# EAGLE design nes2p (EAGLE 7.7.0)
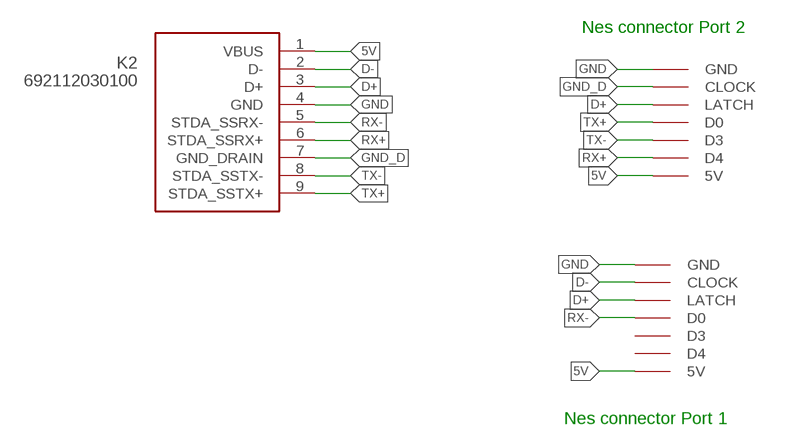
[diagram p0: schematic, sheet 1]

## Parts
K2  692112030100  [692112030100]
U$1  NESCONNNO_TABS  [NESCONN_NO_TABS]
U$2  NESCONNNO_TABS  [NESCONN_NO_TABS]

## Nets
5V: K2.1(VBUS) U$1.5V U$2.5V
D+: K2.3(D+) U$1.LATCH U$2.LATCH
D-: K2.2(D-) U$2.CLOCK
GND: K2.4(GND) U$1.GND U$2.GND
GND_D: K2.7(GND_DRAIN) U$1.CLOCK
RX+: K2.6(STDA_SSRX+) U$1.D4
RX-: K2.5(STDA_SSRX-) U$2.D0
TX+: K2.9(STDA_SSTX+) U$1.D0
TX-: K2.8(STDA_SSTX-) U$1.D3
Unconnected: U$2.D3 U$2.D4

## Notes on the sheet
- Nes connector Port 2
- Nes connector Port 1

## Library data of the parts
K2 = Wuerth_Elektronik_eiCan_Communication_Connectors_STENCIL:692112030100: WR-COM USB 3.0 SMT PLUG WITH CLIPTYPE A
U$1 U$2 = gamepad-conn:NESCONN

## Board
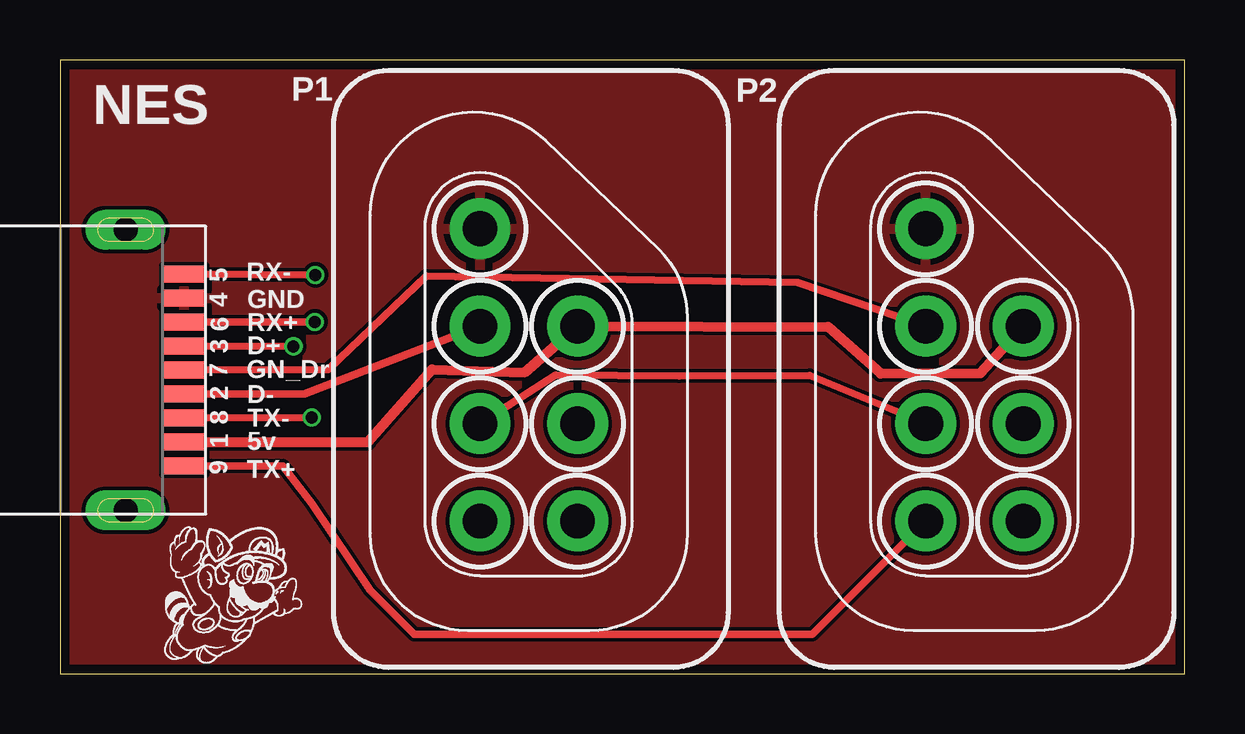
[diagram p1: board, top side]
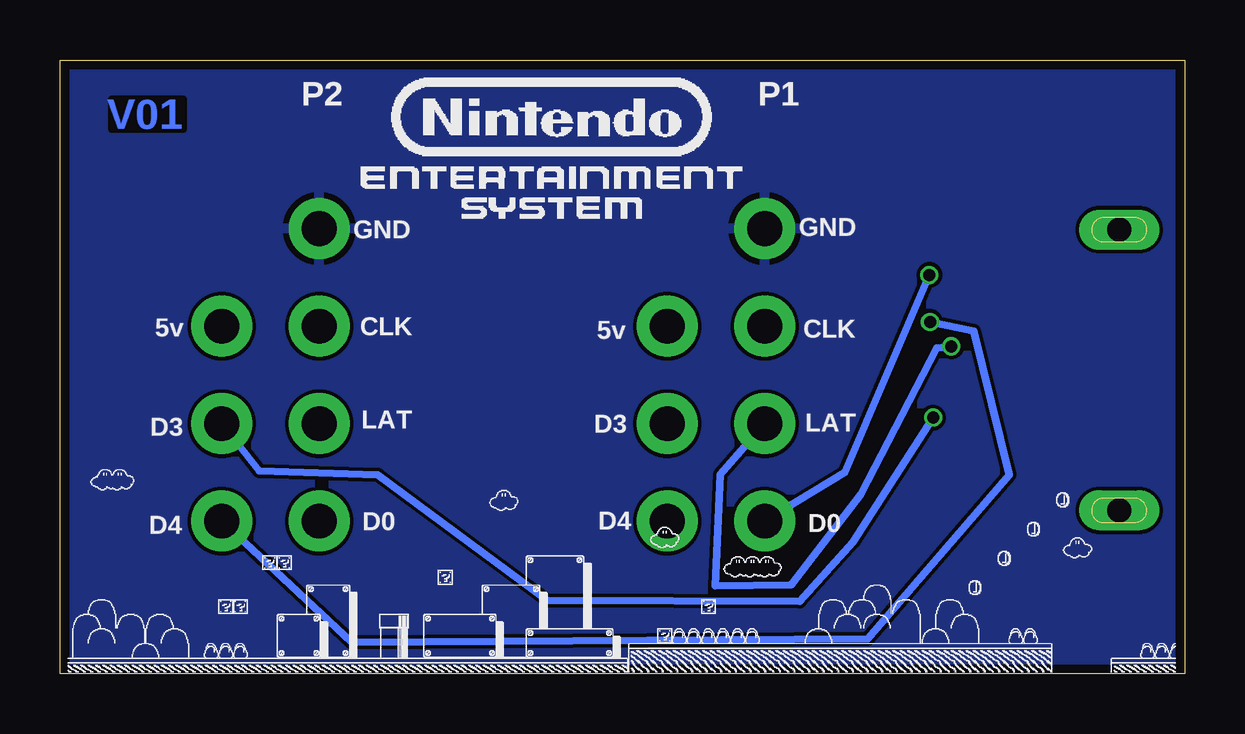
[diagram p2: board, bottom side, seen from below]

Size 46.87 x 25.6 mm. Coordinates in mm from the lower left corner, seen from the top.
Outline: 0,0 46.87,0 46.87,25.6 0,25.6 0,0
Copper layers (1*16): Top 0.035559375mm / dielectric 1.6mm / Bottom 0.035559375mm
Design rules "oshpark-2layer": minimum track width 6mil, minimum drill 10mil, track to track 6mil, track to pad 6mil, pad to pad 6mil, via to via 6mil, smd to smd 6mil, copper to edge 15mil, drill to drill 6mil, minimum pad ring 5mil, minimum via ring 5mil, stop-mask expansion 2.5mil, vias tented up to drill 0mil, thermal gap 10mil

### Footprints (pad centres in the part's own frame; a part is rotated, then mirrored left to right if it is on the bottom)
692112030100 = smd 0.7 x 1.8: 1 -3,0; 2 -1,0; 3 1,0; 4 3,0; 5 4,0; 6 2,0; 7 0,0; 8 -2,0; 9 -4,0 | drill 1 pad 1.676 long: Z1 5.85,2.45; Z2 -5.85,2.45
NESCONN_NO_TABS = drill 1.448 pad 2.54: 5V 8.128,0; CLOCK 8.128,4.064; D0 0,4.064; D3 4.064,0; D4 0,0; GND 12.192,4.064; LATCH 4.064,4.064

### Placement (x,y rotation side)
K2  5.18,12.67 90 top
U$1  40.13,6.38 90 top
U$2  21.56,6.38 90 top

### Tracks (layer width: path | path; a pad name or v marks a point on that pad's centre or on a via)
5V
  Top 0.406: K2.1 12.82,9.67 15.49,12.7 19.36,12.57 U$2.5V 32,14.48 34.19,12.52 38.35,12.55 U$1.5V
D+  (via drill 0.5)
  Top 0.305: U$2.LATCH 20.65,12.47 25.81,12.42 31.24,12.45 U$1.LATCH | K2.3 v9.73,13.67
  Bottom 0.305: v9.73,13.67 10.34,13.59 13.51,7.49 16.41,3.71 19.56,3.68 19.36,8.33 U$2.LATCH
D-
  Top 0.305: K2.2 10.19,11.68 U$2.CLOCK
GND
  pour Bottom: 0.1,25.37 46.69,25.32 46.74,0.08 0.1,-0.03
  pour Top: 0.3,25.45 46.69,25.37 46.76,0.13 0.05,0
GND_D
  Top 0.305: K2.7 11.18,12.7 15.27,16.59 30.73,16.33 U$1.CLOCK
RX+  (via drill 0.5)
  Top 0.305: K2.6 v10.62,14.68
  Bottom 0.305: v10.62,14.68 8.79,14.3 7.32,8.31 13.21,1.47 34.72,1.32 U$1.D4
RX-  (via drill 0.5)
  Top 0.305: K2.5 v10.64,16.64
  Bottom 0.305: v10.64,16.64 14.17,8.41 U$2.D0
TX+
  Top 0.305: K2.9 9.28,8.67 10.49,7.11 12.93,3.48 14.76,1.65 31.34,1.65 U$1.D0
TX-  (via drill 0.5)
  Top 0.305: K2.8 v10.49,10.69
  Bottom 0.305: v10.49,10.69 13.84,5.49 16.05,3.02 26.57,3.07 33.63,8.31 38.56,8.46 U$1.D3

### Text on the board
Bottom: V01
tPlace: P1 | P2 | NES | 5 | RX- | 4 | GND | 6 | RX+ | 3 | D+ | 7 | GN_Dr | 2 | D- | 8 | TX- | 1 | 5v | 9 | TX+
bPlace: P1 | P2 | GND | GND | CLK | 5v | CLK | 5v | LAT | D3 | LAT | D3 | D0 | D4 | D0 | D4